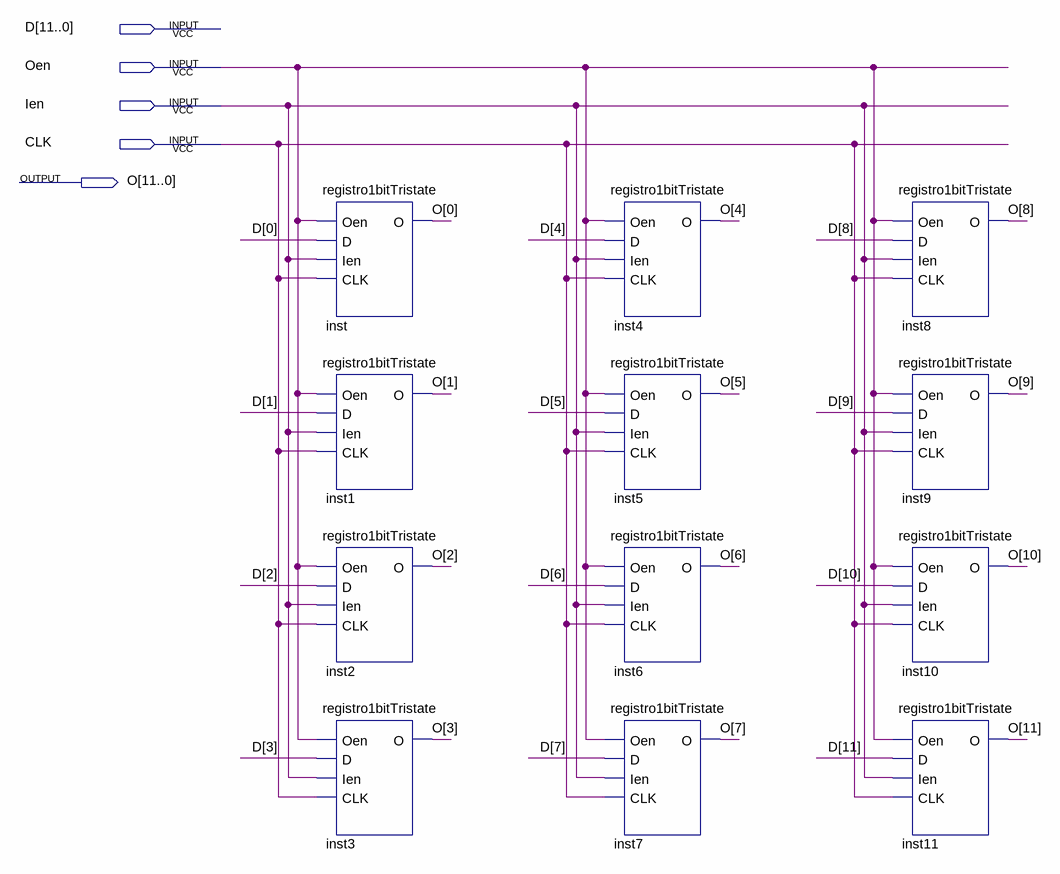
[diagram p0: schematic sheet]
// Quartus schematic registro12bitsTristate.bdf as structural Verilog: 12 symbols, 5 pins
module registro12bitsTristate (
  input  [11:0] D,
  input  Oen,
  input  Ien,
  input  CLK,
  output [11:0] O
);

  registro1bitTristate inst (.Oen(Oen), .D(D[0]), .Ien(Ien), .CLK(CLK), .O(O[0]));
  registro1bitTristate inst1 (.Oen(Oen), .D(D[1]), .Ien(Ien), .CLK(CLK), .O(O[1]));
  registro1bitTristate inst2 (.Oen(Oen), .D(D[2]), .Ien(Ien), .CLK(CLK), .O(O[2]));
  registro1bitTristate inst3 (.Oen(Oen), .D(D[3]), .Ien(Ien), .CLK(CLK), .O(O[3]));
  registro1bitTristate inst4 (.Oen(Oen), .D(D[4]), .Ien(Ien), .CLK(CLK), .O(O[4]));
  registro1bitTristate inst5 (.Oen(Oen), .D(D[5]), .Ien(Ien), .CLK(CLK), .O(O[5]));
  registro1bitTristate inst6 (.Oen(Oen), .D(D[6]), .Ien(Ien), .CLK(CLK), .O(O[6]));
  registro1bitTristate inst7 (.Oen(Oen), .D(D[7]), .Ien(Ien), .CLK(CLK), .O(O[7]));
  registro1bitTristate inst8 (.Oen(Oen), .D(D[8]), .Ien(Ien), .CLK(CLK), .O(O[8]));
  registro1bitTristate inst9 (.Oen(Oen), .D(D[9]), .Ien(Ien), .CLK(CLK), .O(O[9]));
  registro1bitTristate inst10 (.Oen(Oen), .D(D[10]), .Ien(Ien), .CLK(CLK), .O(O[10]));
  registro1bitTristate inst11 (.Oen(Oen), .D(D[11]), .Ien(Ien), .CLK(CLK), .O(O[11]));
endmodule
